# EAGLE schematic fire alarm (EAGLE 9.6.2)
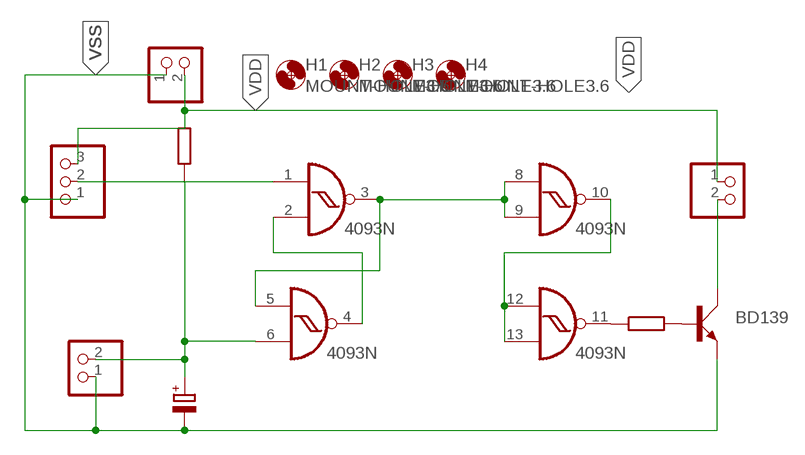
[diagram p0: schematic, sheet 1]

## Parts
C1  CPOL-EUE2.5-5  [E2,5-5]
H1  MOUNT-HOLE3.6  [3,6]
H2  MOUNT-HOLE3.6  [3,6]
H3  MOUNT-HOLE3.6  [3,6]
H4  MOUNT-HOLE3.6  [3,6]
IC1  4093N  [DIL14]
JP1  PINHD-1X2  [1X02]
JP2  PINHD-1X2  [1X02]
JP3  PINHD-1X2  [1X02]
JP4  PINHD-1X3  [1X03]
Q1  BD139  [TO126AV]
R1  R-EU_0207/15  [0207/15]
R2  R-EU_0207/15  [0207/15]

## Nets
N$1: IC1.11(D:O) R1.1
N$2: IC1.2(A:I1) IC1.4(B:O)
N$3: IC1.3(A:O) IC1.5(B:I0) IC1.8(C:I0) IC1.9(C:I1)
N$4: Q1.B R1.2
N$5: IC1.10(C:O) IC1.12(D:I0) IC1.13(D:I1)
N$6: C1.+ IC1.6(B:I1) JP2.2 R2.1
N$8: JP3.2 Q1.C
N$9: IC1.1(A:I0) JP4.2
VDD: JP1.2 JP3.1 JP4.3 R2.2
VSS: C1.- JP1.1 JP2.1 JP4.1 Q1.E

## Power pins joined to a net without a drawn wire
VDD: IC1.14(P:VDD)
VSS: IC1.7(P:VSS)

## Library data of the parts
C1 = rcl:CPOL-EU: POLARIZED CAPACITOR, European symbol; SPICEPREFIX: C
H1-H4 = holes:MOUNT-HOLE: MOUNTING HOLE with drill center marker
IC1 = 40xx:4093: Quad 2-input NAND schmitt trigger
JP1-JP3 = pinhead 2:PINHD-1X2: PIN HEADER
JP4 = pinhead 2:PINHD-1X3: PIN HEADER
Q1 = transistor-power 2:BD139: NPN TRANSISTOR
R1 R2 = rcl:R-EU_: RESISTOR, European symbol; SPICEPREFIX: R